# EAGLE design ARA_Cartridge_V4 (EAGLE 9.5.1)
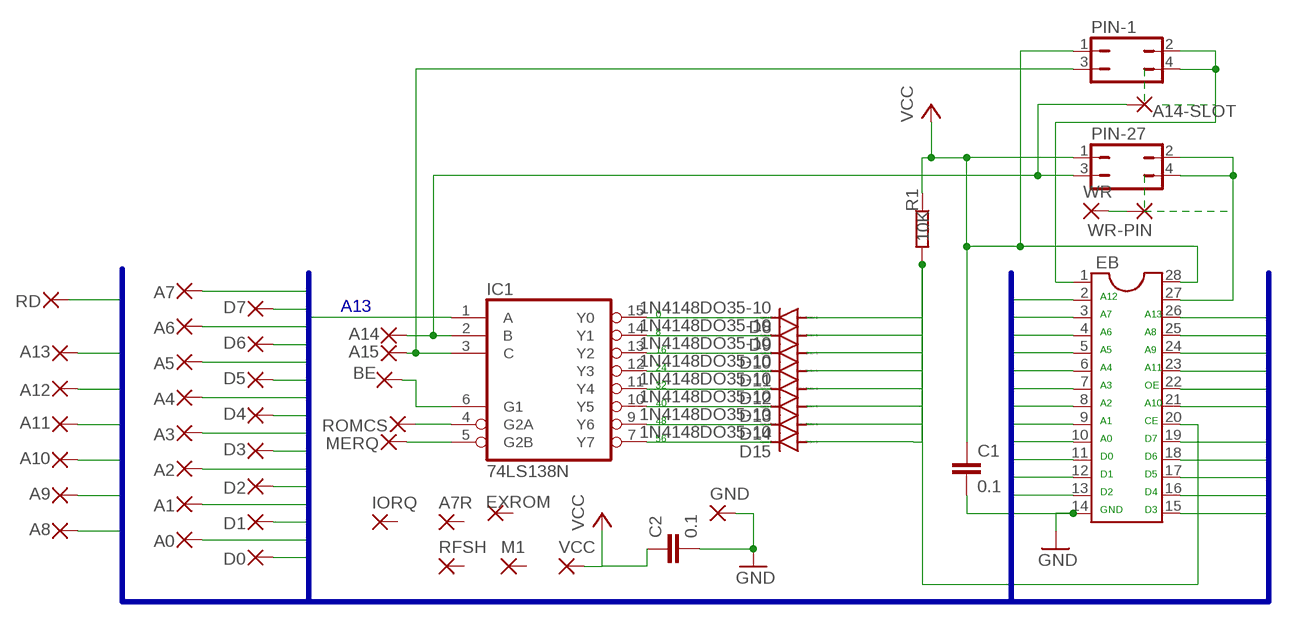
[diagram p0: schematic, sheet 1]

## Parts
A0  SMD2  [SMD2]
A1  SMD2  [SMD2]
A2  SMD2  [SMD2]
A3  SMD2  [SMD2]
A4  SMD2  [SMD2]
A5  SMD2  [SMD2]
A6  SMD2  [SMD2]
A7  SMD2  [SMD2]
A7R  SMD2  [SMD2]
A8  SMD2  [SMD2]
A9  SMD2  [SMD2]
A10  SMD2  [SMD2]
A11  SMD2  [SMD2]
A12  SMD2  [SMD2]
A13  SMD2  [SMD2]
A14  SMD2  [SMD2]
A14-SLOT  1,6/0,8  [1,6/0,8]
A15  SMD2  [SMD2]
BE  SMD2  [SMD2]
C1  0.1  C2,5-3  [C2.5-3]
C2  0.1  C2,5-3  [C2.5-3]
D0  SMD2  [SMD2]
D1  SMD2  [SMD2]
D2  SMD2  [SMD2]
D3  SMD2  [SMD2]
D4  SMD2  [SMD2]
D5  SMD2  [SMD2]
D6  SMD2  [SMD2]
D7  SMD2  [SMD2]
D8  1N4148DO35-10  [DO35-10]
D9  1N4148DO35-10  [DO35-10]
D10  1N4148DO35-10  [DO35-10]
D11  1N4148DO35-10  [DO35-10]
D12  1N4148DO35-10  [DO35-10]
D13  1N4148DO35-10  [DO35-10]
D14  1N4148DO35-10  [DO35-10]
D15  1N4148DO35-10  [DO35-10]
EB  DIL28  [DIL28-6]
EXROM  SMD2  [SMD2]
GND  SMD2  [SMD2]
IC1  74LS138N  [DIL16]
IORQ  SMD2  [SMD2]
M1  SMD2  [SMD2]
MERQ  SMD2  [SMD2]
PIN-1  JP2Q  [JP2Q]
PIN-27  JP2Q  [JP2Q]
R1  10K  R-EU_0207/10  [0207/10]
RD  SMD2  [SMD2]
RFSH  SMD2  [SMD2]
ROMCS  SMD2  [SMD2]
VCC  SMD2  [SMD2]
WR  SMD2  [SMD2]
WR-PIN  1,6/0,8  [1,6/0,8]

## Nets
A0: A0.1(P) EB.10
A1: A1.1(P) EB.9
A2: A2.1(P) EB.8
A3: A3.1(P) EB.7
A4: A4.1(P) EB.6
A5: A5.1(P) EB.5
A6: A6.1(P) EB.4
A7: A7.1(P) EB.3
A8: A8.1(P) EB.25
A9: A9.1(P) EB.24
A10: A10.1(P) EB.21
A11: A11.1(P) EB.23
A12: A12.1(P) EB.2
A13: A13.1(P) EB.26 IC1.1(A)
A14-EP: EB.27 PIN-27.2 PIN-27.4
A14-I: A14-SLOT.1(P) A14.1(P) IC1.2(B) PIN-27.3
A15-EP: EB.1 PIN-1.2 PIN-1.4
A15-I: A15.1(P) IC1.3(C) PIN-1.3
B0: D8.C IC1.15(Y0)
B1: D9.C IC1.14(Y1)
B2: D10.C IC1.13(Y2)
B3: D11.C IC1.12(Y3)
B4: D12.C IC1.11(Y4)
B5: D13.C IC1.10(Y5)
B6: D14.C IC1.9(Y6)
B7: D15.C IC1.7(Y7)
BE: BE.1(P) IC1.6(G1)
D0: D0.1(P) EB.11
D1: D1.1(P) EB.12
D2: D2.1(P) EB.13
D3: D3.1(P) EB.15
D4: D4.1(P) EB.16
D5: D5.1(P) EB.17
D6: D6.1(P) EB.18
D7: D7.1(P) EB.19
GND: C1.2 C2.2 EB.14 GND.1(P)
N$4: D8.A D9.A D10.A D11.A D12.A D13.A D14.A D15.A EB.20 R1.2
N$6: IC1.5(G2B) MERQ.1(P)
N$16: IC1.4(G2A) ROMCS.1(P)
RD: EB.22 RD.1(P)
VCC: C1.1 C2.1 EB.28 PIN-1.1 PIN-27.1 R1.1 VCC.1(P)
WR: WR-PIN.1(P) WR.1(P)
Unconnected: A7R.1(P) EXROM.1(P) IORQ.1(P) M1.1(P) RFSH.1(P)

## Buses
A[0..15],D[0..7],RD,ROMCS

## Notes on the sheet
- A13 | A12
- 0 | A7 | A13
- 8 | A6 | A8
- 16 | A5 | A9
- 24 | A4 | A11
- 32 | A3 | OE
- 40 | A2 | A10
- 48 | A1 | CE
- 56 | A0 | D7
- D0 | D6
- D1 | D5
- D2 | D4
- GND | D3

## Power pins joined to a net without a drawn wire
GND: IC1.8(GND)
VCC: IC1.16(VCC)

## Library data of the parts
A0 A1-A7 A7R A8-A15 BE D0 D1-D7 EXROM GND IORQ M1 MERQ RD RFSH ROMCS VCC WR = wirepad:SMD2: SMD PAD
A14-SLOT WR-PIN = wirepad:1,6/0,8: THROUGH-HOLE PAD
C1 C2 = capacitor-wima:C: CAPACITOR naming: grid - package width
D8-D15 = diode:1N4148: DIODE high speed (Philips)
EB = dil:DIL28: SOCKET Dual In Line
IC1 = 74xx-eu:74*138: 3-line to 8-line DECODER/DEMULTIPLEXER
PIN-1 PIN-27 = jumper:JP2Q: JUMPER
R1 = rcl:R-EU_: RESISTOR, European symbol

## Board
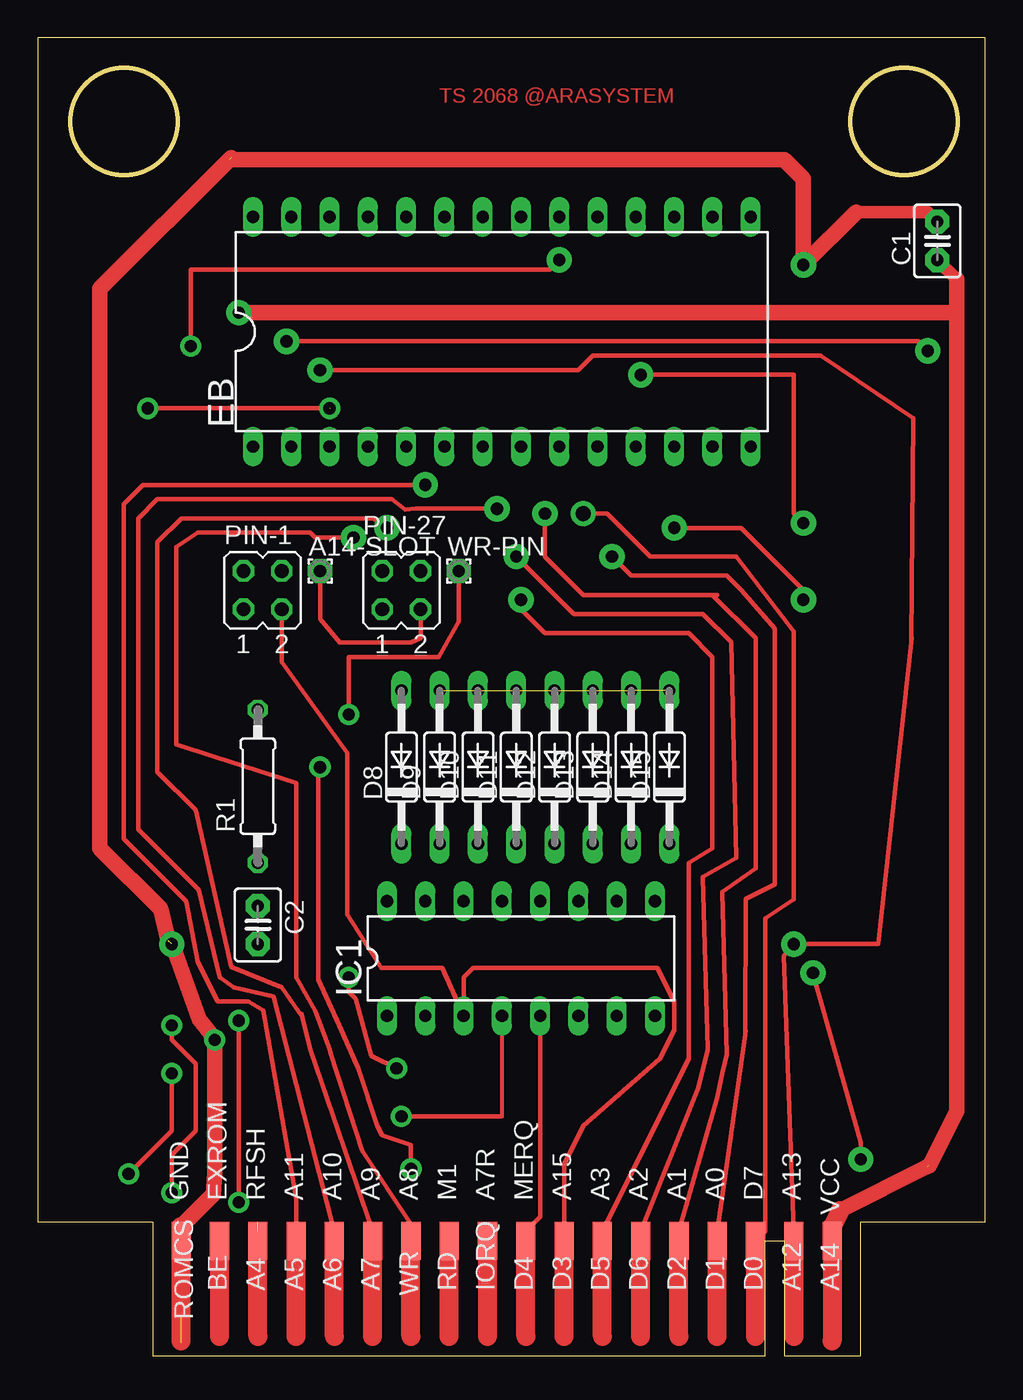
[diagram p1: board, top side]
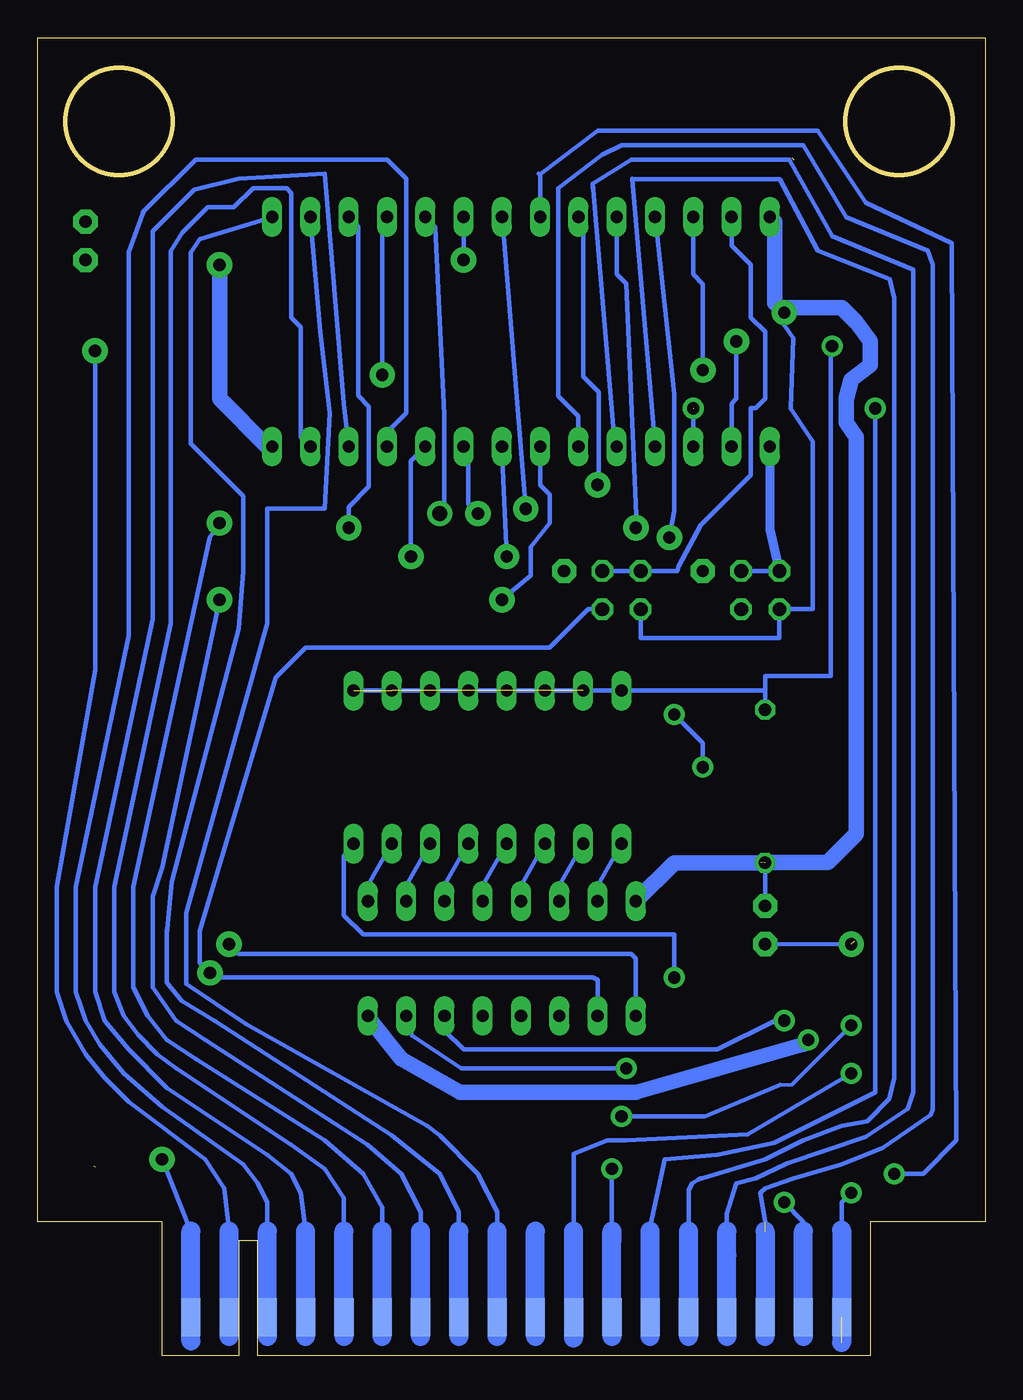
[diagram p2: board, bottom side, seen from below]

Size 62.87 x 87.47 mm. Coordinates in mm from the lower left corner, seen from the top.
Outline: 54.6,8.89 62.87,8.89 62.86,87.47 0.01,87.47 0,8.89 7.62,8.89 7.62,0 48.26,0 48.26,7.62 49.53,7.62 49.53,0 54.6,0 54.6,8.89
Outline: circle at 5.71,81.92 radius 3.55
Outline: circle at 57.47,81.92 radius 3.55
Copper layers (1*16): Top 0.035mm / dielectric 1.5mm / Bottom 0.035mm
Design rules "default": minimum track width 10mil, minimum drill 24mil, track to track 8mil, track to pad 8mil, pad to pad 8mil, via to via 8mil, smd to smd 8mil, copper to edge 40mil, drill to drill 8mil, minimum pad ring 10mil, minimum via ring 8mil, stop-mask expansion 4mil, vias tented up to drill 0mil, thermal gap 10mil

### Footprints (pad centres in the part's own frame; a part is rotated, then mirrored left to right if it is on the bottom)
SMD2 = smd 1.27 x 2.54: 1 0,0
1,6/0,8 = drill 0.813 pad 1.6 octagon: 1 0,0
C2.5-3 = drill 0.813 pad 1.6 octagon: 1 -1.27,0; 2 1.27,0
DO35-10 = drill 0.813 long: A 5.08,0; C -5.08,0
DIL28-6 = drill 0.813 long: 1 -16.51,-7.62; 2 -13.97,-7.62; 3 -11.43,-7.62; 4 -8.89,-7.62; 5 -6.35,-7.62; 6 -3.81,-7.62; 7 -1.27,-7.62; 8 1.27,-7.62; 9 3.81,-7.62; 10 6.35,-7.62; 11 8.89,-7.62; 12 11.43,-7.62; 13 13.97,-7.62; 14 16.51,-7.62; 15 16.51,7.62; 16 13.97,7.62; 17 11.43,7.62; 18 8.89,7.62; 19 6.35,7.62; 20 3.81,7.62; 21 1.27,7.62; 22 -1.27,7.62; 23 -3.81,7.62; 24 -6.35,7.62; 25 -8.89,7.62; 26 -11.43,7.62; 27 -13.97,7.62; 28 -16.51,7.62
DIL16 = drill 0.813 long: 1 -8.89,-3.81; 2 -6.35,-3.81; 3 -3.81,-3.81; 4 -1.27,-3.81; 5 1.27,-3.81; 6 3.81,-3.81; 7 6.35,-3.81; 8 8.89,-3.81; 9 8.89,3.81; 10 6.35,3.81; 11 3.81,3.81; 12 1.27,3.81; 13 -1.27,3.81; 14 -3.81,3.81; 15 -6.35,3.81; 16 -8.89,3.81
JP2Q = drill 0.914 octagon: 1 -1.27,-1.27; 2 -1.27,1.27; 3 1.27,-1.27; 4 1.27,1.27
0207/10 = drill 0.813 octagon: 1 -5.08,0; 2 5.08,0

### Placement (x,y rotation side)
A0  45.09,7.62 180 top
A1  42.55,7.62 180 top
A2  40.01,7.62 180 top
A3  37.47,7.62 180 top
A4  14.61,2.54 180 bottom
A5  17.14,2.54 180 bottom
A6  19.68,2.54 180 bottom
A7  22.23,2.54 180 bottom
A7R  29.84,7.62 180 top
A8  24.77,7.62 180 top
A9  22.23,7.62 180 top
A10  19.68,7.62 180 top
A11  17.14,7.62 180 top
A12  50.16,2.54 180 bottom
A13  50.16,7.62 180 top
A14  52.7,2.54 180 bottom
A14-SLOT  18.73,52.07 0 top
A15  34.92,7.62 180 top
BE  12.06,2.54 180 bottom
C1  59.69,73.98 90 top
C2  14.61,28.58 270 top
D0  47.62,2.54 180 bottom
D1  45.09,2.54 180 bottom
D2  42.55,2.54 180 bottom
D3  34.92,2.54 180 bottom
D4  32.38,2.54 180 bottom
D5  37.47,2.54 180 bottom
D6  40.01,2.54 180 bottom
D7  47.62,7.62 180 top
D8  24.13,39.05 90 top
D9  26.67,39.05 90 top
D10  29.21,39.05 90 top
D11  31.75,39.05 90 top
D12  34.29,39.05 90 top
D13  36.83,39.05 90 top
D14  39.37,39.05 90 top
D15  41.91,39.05 90 top
EB  30.8,67.95 0 top
EXROM  12.06,7.62 180 top
GND  9.53,7.62 180 top
IC1  32.07,26.35 0 top
IORQ  29.84,2.54 180 bottom
M1  27.3,7.62 180 top
MERQ  32.38,7.62 180 top
PIN-1  14.92,50.8 0 top
PIN-27  24.13,50.8 0 top
R1  14.61,37.78 90 top
RD  27.3,2.54 180 bottom
RFSH  14.61,7.62 180 top
ROMCS  9.53,2.54 180 bottom
VCC  52.7,7.62 180 top
WR  24.77,2.54 180 bottom
WR-PIN  27.94,52.07 0 top

### Tracks (layer width: path | path; a pad name or v marks a point on that pad's centre or on a via)
A0  (via drill 0.81 pad 1.68)
  Top 0.305: 45.09,8.26 46.95,21.28 | 46.95,21.28 46.99,21.59 | 46.99,50.48 46.67,50.8 | 46.67,50.8 45.72,51.75 39.37,51.75 v38.1,53.02 | 46.67,50.8 48.9,48.26 48.9,31.27 46.97,30.31 46.95,21.28
  Top 1.27: 45.09,1.27 A0.1 45.09,8.26
  Bottom 0.305: EB.10 38.1,59.37 v38.1,53.02
A1  (via drill 0.81 pad 1.68)
  Top 0.305: 42.55,8.26 45.09,17.15 45.4,18.73 45.72,20 45.43,30.77 47.62,32.34 47.62,47.62 44.77,50.48 | 45.09,50.48 44.77,50.48 | 44.77,50.48 36.2,50.48 33.66,53.02 v33.66,55.88
  Top 1.27: 42.55,1.27 A1.1 42.55,8.26
  Bottom 0.305: EB.9 34.29,60.01 34.29,56.52 v33.66,55.88
A2  (via drill 0.81 pad 1.68)
  Top 0.305: 40.01,8.26 43.81,17.78 44.45,20.32 44.13,31.75 46.35,33.02 46.01,47.34 44.13,49.21 35.56,49.21 v31.75,53.02
  Top 1.27: 40.01,1.27 A2.1 40.01,8.26
  Bottom 0.305: EB.8 v31.75,53.02
A3  (via drill 0.81 pad 1.68)
  Top 0.305: 37.47,8.26 43.18,19.69 43.18,32.7 44.77,33.66 44.77,46.35 43.18,47.94 33.66,47.94 31.75,49.85 v32.07,50.16
  Top 1.27: 37.47,1.27 A3.1 37.47,8.26
  Bottom 0.305: 29.19,59.39 29.53,59.73 EB.7 29.53,57.78 28.89,57.15 28.89,55.24 30.16,53.66 30.16,51.75 v32.07,50.16 31.64,50.59
A4  (1 unrouted)
  Bottom 0.305: EB.6 26.99,62.34 28.32,63.67 28.32,77.47 25.4,79.69 24.13,80.33 12.06,80.33 9.21,75.57 3.81,73.34 3.49,72.39 3.49,16.35 3.6,15.97 6.81,13.77 9.53,12.7 12.7,11.75 14.61,11.11 14.92,10.79 14.61,8.89
  Bottom 1.27: 14.61,1.27 A4.1 14.61,8.26
A5
  Bottom 0.305: 26.04,77.47 26.04,77.79 | 17.14,8.26 17.14,9.42 16.51,11.43 15.24,11.75 13.12,12.77 7.94,14.5 5.12,16.37 4.76,17.46 4.76,72.07 10.16,74.3 13.02,79.38 23.5,79.38 26.04,77.79 | 26.04,77.79 24.57,60.44 EB.5
  Bottom 1.27: 17.14,1.27 A5.1 17.14,6.67 | 17.14,6.67 17.14,8.26 | 17.14,6.67
A6
  Bottom 0.305: 19.68,7.62 19.68,11.01 19.42,11.44 19.01,11.68 | 18.88,11.75 19.01,11.68 | 23.41,78.11 23.41,78.09 | 23.41,78.09 EB.4 | 23.41,78.09 13.63,78.09 11.11,73.34 6.35,71.44 6.03,70.17 6.03,18.42 6.38,17.02 7.84,15.56 9.53,15.24 12.06,14.29 14.61,13.02 19.01,11.68
  Bottom 1.27: 19.68,1.27 A6.1 19.68,7.62 19.68,8.26
A7  (via drill 0.81 pad 1.4)  (1 unrouted)
  Top 0.305: v7.3,62.86 v19.37,62.86
  Bottom 0.305: v7.3,62.86 7.3,17.46 14.01,14.11 17.78,13.33 21.27,13.02 22.23,8.57 | 22.23,8.26 22.23,8.57 | 22.23,8.57 22.23,8.73 | EB.3 v19.37,62.86
  Bottom 1.27: 22.23,1.27 A7.1 22.23,8.26
A8  (via drill 0.81 pad 1.68)
  Top 0.305: v20.95,54.29 18.41,54.29 18.1,54.61 10.64,54.61 9.21,53.66 9.21,40.55 17.14,38 17.14,25.08 18.41,22.86 19.37,20.32 19.46,20.03 21.54,13.58 24.77,8.73 A8.1
  Top 1.27: 24.77,8.26 A8.1 24.77,1.27
  Bottom 0.305: 21.72,75.38 EB.25 20.64,63.82 20.64,56.04 v20.95,54.29 21.27,53.98
  Bottom 0.61: 21.91,74.61 EB.25
A9  (via drill 0.81 pad 1.68)
  Top 0.305: 23.18,55.24 v23.18,54.93 22.23,55.56 9.53,55.56 7.94,53.98 7.94,38.73 10.48,36.2 12.83,25.79 16.19,24.45 17.56,22.49 | 17.51,22.68 17.56,22.49 | 17.56,22.49 18.1,20.32 22.23,8.26
  Top 1.27: 22.23,1.27 A9.1 22.23,8.26
  Bottom 0.305: v23.18,54.93 23.11,55.01 23.83,71.14 24.45,71.76 EB.24
A10  (via drill 0.81 pad 1.68)
  Top 0.305: 19.68,8.26 15.65,23.76 15.63,23.83 | 15.63,23.83 | 30.16,56.52 v30.48,56.2 25.08,56.2 24.39,56.16 23.5,56.83 7.94,56.83 6.67,55.56 6.67,34.92 10.7,30.9 12.06,25.08 13.02,24.45 15.63,23.83
  Top 1.27: 19.68,8.26 A10.1 19.68,1.27
  Bottom 0.305: EB.21 32.04,75.54 v30.48,56.2
A11  (via drill 0.81 pad 1.68)
  Top 0.305: A11.1 17.14,10.4 14.97,22.9 13.97,23.5 11.94,23.5 10.63,26.12 9.86,30.14 5.71,34.29 5.71,56.52 6.99,57.78 v25.72,57.78
  Top 1.27: 17.14,1.27 A11.1
  Bottom 0.305: EB.23 26.67,75.25 26.67,64.96 25.65,63.95 25.65,57.85 v25.72,57.78
A12  (via drill 0.81 pad 1.68)
  Top 0.305: v59.05,66.68 58.42,67.31 v16.51,67.31
  Bottom 0.305: 50.16,8.26 50.48,11.11 51.75,13.02 56.83,16.83 58.42,18.42 59.69,20 60.96,22.23 61.59,24.13 61.59,31.12 59.05,45.51 v59.05,66.68 | v16.51,67.31 16.51,63.5 16.83,63.18 EB.2
  Bottom 1.27: 50.16,1.27 A12.1 50.16,8.26
A13  (via drill 0.81 pad 1.68)
  Top 0.305: 50.16,8.26 49.51,26.52 v50.16,27.31 55.77,27.31 57.95,47.32 | 57.98,47.67 57.95,47.32 | v18.73,65.41 35.88,65.41 36.83,66.36 51.96,66.36 58.1,62.23 57.95,47.32
  Top 1.27: 50.16,1.27 A13.1 50.16,8.26
  Bottom 0.305: v50.16,27.31 49.53,26.67 23.5,26.67 23.18,26.35 IC1.1 | EB.26 19.37,71.76 18.73,71.12 v18.73,65.41
A14
  Bottom 1.27: 52.7,0.95 52.7,8.26
A14-EP
  Bottom 0.305: EB.27 16.83,73.66 15.56,72.39 15.56,68.9 14.61,67.95 14.61,63.5 15.24,62.86 15.56,62.86 15.56,58.42 18.87,55.11 20.32,52.39 20.43,52.07 PIN-27.2 PIN-27.4
A14-I  (via drill 0.81 pad 1.68)
  Top 0.305: v54.61,13.02 54.61,14.14 v51.44,25.4 | A14-SLOT.1 18.73,48.89 20.05,47.31 24.77,47.31 25.4,47.62 PIN-27.3
  Bottom 0.305: v54.61,13.02 52.7,8.26 | IC1.2 25.72,24.92 26.04,25.08 51.12,25.08 v51.44,25.4 52.11,26.07 52.11,28.18 47.08,44.99 45.09,46.99 28.89,46.99 26.35,49.53 PIN-27.3
  Bottom 0.61: 52.7,8.26 A14.1
A15
  Top 1.27: 34.92,1.27 34.92,8.26
A15-EP
  Bottom 0.305: 15.24,52.07 PIN-1.4 PIN-1.2
  Bottom 0.61: EB.1 14.29,54.82 PIN-1.2
A15-I
  Top 0.305: A15.1 34.92,12.7 36.2,15.24 41.27,19.69 42.23,21.59 42.23,23.5 41.12,25.72 28.89,25.72 28.26,25.08 IC1.3 26.85,25.72 22.8,25.72 20.54,29.28 20.54,40 | 20.54,40 | PIN-1.3 16.19,46.04 20.54,40
B0
  Bottom 0.305: IC1.15 25.72,31.19 D8.C
B1
  Bottom 0.305: IC1.14 28.26,31.19 D9.C
B2
  Bottom 0.305: IC1.13 30.8,31.19 D10.C
B3
  Bottom 0.305: IC1.12 33.34,31.19 D11.C
B4
  Bottom 0.305: IC1.11 35.88,31.19 D12.C
B5
  Bottom 0.305: IC1.10 38.42,31.19 D13.C
B6
  Bottom 0.305: IC1.9 40.96,31.19 D14.C
B7  (via drill 0.81 pad 1.4)
  Top 0.305: v23.81,19.05 22.14,19.89 21.11,23.65 20.64,24.13 v20.64,25.08
  Bottom 0.305: D15.C 42.55,33.16 42.55,29.21 41.27,27.94 20.64,27.94 v20.64,25.08 | IC1.7 38.04,21.24 34.77,19.05 v23.81,19.05
BE  (via drill 0.81 pad 1.4)
  Top 0.305: v13.34,22.23 v13.34,10.16
  Bottom 0.305: v13.34,22.23 13.97,22.23 17.78,20.32 34.61,20.32 35.88,21.59 IC1.6 | BE.1 12.06,8.89 v13.34,10.16
D0
  Bottom 0.305: 47.62,8.26 47.62,10.16 48.26,11.43 49.21,12.7 54.61,16.51 57.15,18.73 58.74,20.64 59.69,22.23 60.33,24.13 60.33,31.12 56.83,47.8 56.83,73.24 55.88,75.78 | 55.88,75.78 55.84,75.88 | EB.11 39.69,61.28 38.42,62.55 38.42,78.11 39.69,79.38 52.39,79.38 55.88,75.88 55.88,75.78
  Bottom 1.27: 47.62,1.27 D0.1 47.62,8.26
D1
  Bottom 0.305: 45.09,8.26 45.4,10.79 46.04,12.06 47.62,13.33 54.29,17.78 56.83,20.32 58.42,22.23 59.05,24.13 59.05,31.12 55.24,48.89 55.24,74.61 52.49,77.36 49.53,78.11 43.81,78.42 43.18,70.8 42.55,63.18 EB.12
  Bottom 1.27: 45.09,1.27 D1.1 45.09,8.26
D2
  Bottom 0.305: 42.55,8.26 42.55,10.48 43.81,12.38 46.04,13.97 53.66,19.05 54.93,20 56.2,21.27 57.15,22.54 57.78,24.13 57.78,31.12 54.04,48.59 54.04,73.3 53.26,74.52 51.58,76.2 49.85,76.2 48.58,77.47 46.35,77.47 46.04,77.15 46.04,68.9 45.4,68.26 45.4,60.96 EB.13
  Bottom 1.27: 42.55,1.27 D2.1 42.55,8.26
D3
  Bottom 0.305: 34.92,8.26 34.92,9.53 36.2,12.06 39.37,14.61 51.12,22.23 53.32,23.54 54.29,24.77 54.29,27.94 | 54.29,27.94 54.29,28.26 | 54.29,27.94 53.98,31.43 49.53,48.26 49.21,52.07 49.21,57.02 52.7,60.52 52.7,73.18 52.1,74.09 EB.15
  Bottom 1.27: 34.92,1.27 D3.1 34.92,8.26
D4
  Bottom 0.305: 32.38,8.26 32.38,9.53 33.66,12.06 36.2,14.61 37.03,15.23 49.05,22.01 53.02,24.66 53.02,29.39 47.62,48.58 47.62,56.2 43.81,56.2 43.5,62.55 44.13,67.95 EB.16
  Bottom 1.27: 32.38,1.27 D4.1 32.38,8.26
D5  (via drill 0.81 pad 1.68)
  Top 0.305: v50.8,50.16 50.8,50.8 46.67,54.93 v42.23,54.93
  Bottom 0.305: 37.47,8.26 37.47,9.53 38.73,12.06 40.96,13.97 51.75,20.96 53.66,22.23 55.24,24.45 55.24,30.48 54.61,32.38 v50.8,50.16 | EB.17 41.59,74.93 41.59,63.69 40.89,62.99 40.89,57.66 42.23,56.32 v42.23,54.93
  Bottom 1.27: 37.47,1.27 D5.1 37.47,8.26
D6  (via drill 0.81 pad 1.68)
  Top 0.305: v50.8,55.24 50.16,55.88 50.16,65.09 v40.01,65.09
  Bottom 0.305: 40.01,8.26 40.01,9.84 41.27,12.06 43.81,14.29 52.39,19.69 54.29,20.96 55.56,22.54 56.52,24.45 56.52,31.12 51.44,54.29 v50.8,55.24 | EB.18 40.01,75.25 v40.01,65.09
  Bottom 1.27: 40.01,1.27 D6.1 40.01,8.26
D7  (via drill 1.02 pad 1.68)
  Top 0.305: D7.1 48.26,8.26 48.26,29 50.16,30.27 50.16,48.04 46.33,53.02 40.64,53.02 37.78,55.88 v36.2,55.88
  Top 1.27: 47.62,1.27 D7.1
  Bottom 0.305: 36.13,55.94 v36.2,55.88 35.88,56.2 35.88,62.44 36.48,74.9 EB.19
GND  (via drill 0.81 pad 1.4, 0.81 pad 1.68)  (2 unrouted)
  Top 0.813: 54.29,75.88 59.05,75.88 C1.2
  Top 1.016: 9.53,8.57 11.66,10.7 11.75,12.06 v11.75,20.96 11.75,21.02 10.72,22.3 8.96,27.23 v8.89,27.31 | 8.67,27.53 8.15,29.63 4.13,33.66 4.13,70.8 12.83,79.5 | 12.7,79.38 49.53,79.38 50.8,78.11 v50.8,72.39 54.29,75.88
  Top 1.27: 9.53,0.95 GND.1 9.53,8.57
  Bottom 0.254: C2.2 v8.89,27.31
  Bottom 0.305: 40.96,22.46 IC1.8 | 47.62,60.32 EB.14
  Bottom 0.61: v50.8,72.39 50.8,71.91
  Bottom 1.016: 40.96,22.46 38.73,19.69 34.85,17.46 23.18,17.46 12.06,20.64 v11.75,20.96 | v50.8,72.39 50.8,63.5 47.62,60.32
N$4  (via drill 0.81 pad 1.4, 0.81 pad 1.68)  (6 unrouted)
  Top 0.305: v10.16,66.99 10.16,72.07 33.97,72.07 v34.61,72.71
  Bottom 0.305: v10.16,66.99 10.24,66.99 10.24,45.09 14.61,45.09 14.61,44.13 | R1.2 14.61,44.13 | v34.61,72.71 EB.20 | D15.A D8.A 14.61,44.13
N$6
  Top 0.305: IC1.5 33.34,9.21 32.38,8.26
  Top 1.27: 32.38,1.27 MERQ.1 32.38,8.26
N$9
  Bottom 1.27: 24.77,1.27 24.77,7.62 24.77,8.26
N$16  (via drill 0.81 pad 1.4)  (1 unrouted)
  Top 0.254: IC1.4 30.8,15.88
  Top 0.305: 30.8,15.88 v24.13,15.88 | v8.89,21.91 8.89,20.96 10.48,19.37 10.48,14.92 8.89,13.33 v8.89,10.79
  Bottom 0.254: 18.61,15.88 13.63,17.97 12.81,17.98 v8.89,21.91
  Bottom 0.305: v24.13,15.88 18.61,15.88 | 9.53,8.33 | v8.89,10.79 9.53,10.16 9.53,8.33
  Bottom 1.27: 9.53,8.33 9.53,0.85
N$27
  Top 1.27: 29.84,1.27 29.84,8.26
N$28
  Top 1.27: 27.3,1.27 27.3,8.26
N$29
  Top 1.27: 12.06,1.27 12.06,8.26
N$30
  Top 1.27: 14.61,1.27 14.61,8.26
N$31
  Bottom 1.27: 12.06,1.27 12.06,8.26
N$33
  Bottom 1.27: 29.84,1.27 29.84,8.26
RD  (via drill 0.81 pad 1.4)
  Top 0.305: v8.89,18.73 8.89,14.92 v6.03,12.06
  Bottom 0.305: 29.61,78.42 29.53,78.42 | EB.22 29.53,78.42 | v6.03,12.06 4.13,12.06 1.93,14.27 2.23,73.81 7.94,76.52 11.11,81.28 25.72,81.28 29.53,78.42 | 27.3,8.26 27.3,13.4 25.08,14.29 23.81,14.29 15.76,14.67 v8.89,18.73
  Bottom 1.27: 27.3,8.26 RD.1 27.3,1.17
VCC  (via drill 0.81 pad 1.68)  (2 unrouted)
  Top 0.61: 52.7,8.57 52.7,8.26
  Top 0.813: C1.1 60.96,71.44
  Top 1.016: 59.16,12.58 60.96,16.19 60.96,69.22 | 60.96,69.22 v13.34,69.22 | 60.96,71.44 60.96,69.22 | 53.23,9.63 59,12.51
  Top 1.27: 52.7,0.95 VCC.1 52.7,8.26 | 53.23,9.63 52.7,8.57
  Bottom 0.254: IC1.16 22.86,30.48
  Bottom 0.305: 13.97,69.85 v13.34,69.22 | EB.28 13.97,75.25 | v13.34,69.22 13.34,69.53 | 15.24,33.02 14.92,33.02 R1.1 C2.1 | PIN-27.1 22.86,47.62 13.65,47.62 PIN-1.1 11.43,49.53 11.43,60.64 12.9,62.85 12.73,67.54 13.34,68.39 v13.34,69.22
  Bottom 1.016: R1.1 20.64,32.7 IC1.16 | 13.97,75.25 13.97,69.85 | 13.34,69.53 9.53,69.53 8.57,68.58 7.62,67.31 7.62,65.72 8.89,64.77 9.21,63.5 9.21,61.91 8.57,60.96 8.57,34.61 10.45,32.73 14.89,32.73
WR  (via drill 0.81 pad 1.4)
  Top 0.305: v24.77,12.38 24.77,13.97 22.86,14.61 22.54,15.24 21.27,19.05 20,21.91 18.63,24.95 18.63,38.95 v18.73,39.05 | 27.94,51.75 WR-PIN.1 27.94,48.71 26.61,46.35 20.64,46.35 v20.64,42.54
  Bottom 0.305: 24.77,8.26 v24.77,12.38 | v20.64,42.54 18.73,40.64 v18.73,39.05
  Bottom 1.27: WR.1 24.77,8.26

### Text on the board
Top: TS 2068 @ARASYSTEM